# Altium schematic sheet lightSoakV1-InAmp-piggyback-sch.SchDoc
size A4; SheetNumber: 1; SheetTotal: 1
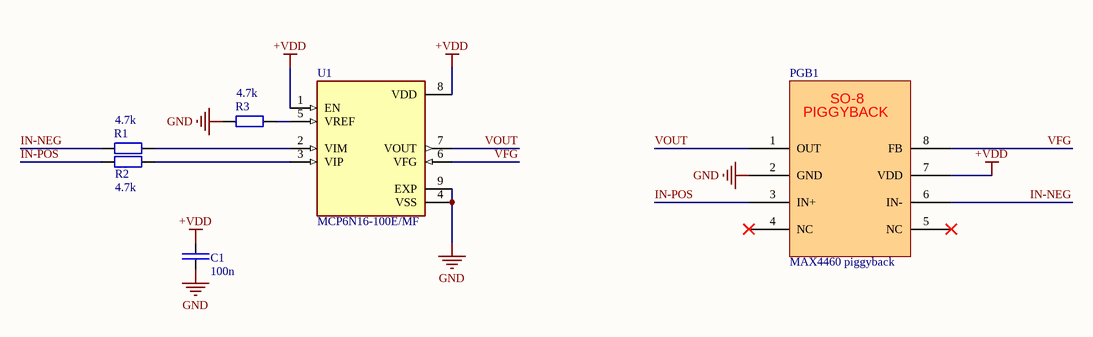
[diagram p0: lightSoakV1-InAmp-piggyback-sch.SchDoc]

## Parts
C1  value 100n  [FPR_0402_C_R0]  (hidden comment: PN_C_100n)
PGB1  MAX4460 piggyback  [SO-8 piggyback]
R1  value 4.7k  [FPR_0402_R_R0]  (hidden comment: PN_R_4k7)
R2  value 4.7k  [FPR_0402_R_R0]  (hidden comment: PN_R_4k7)
R3  value 4.7k  [FPR_0402_R_R0]  (hidden comment: PN_R_4k7)
U1  MCP6N16-100E/MF  [SON65P300X300X100-9N]

## Nets
+VDD: C1.2 PGB1.7(VDD) U1.1(EN) U1.8(VDD)
GND: C1.1 PGB1.2(GND) R3.2 U1.4(VSS) U1.9(EXP)
IN-NEG: PGB1.6(IN-) R1.2
IN-POS: PGB1.3(IN+) R2.2
VFG: PGB1.8(FB) U1.6(VFG)
VOUT: PGB1.1(OUT) U1.7(VOUT)
NetR1_1: R1.1 U1.2(VIM)
NetR2_1: R2.1 U1.3(VIP)
NetR3_1: R3.1 U1.5(VREF)

Not connected (* = marked no-connect by the designer): PGB1 4(NC)* 5(NC)*

## Notes on the sheet
- (in symbol MAX4460 piggyback) SO-8; PIGGYBACK

## Library data of the parts
C1 = C: Capacitor - generic SMD
R1-R3 = R: Resistor - generic SMD
U1 = MCP6N16-100E/MF: Instrumentation Amplifier 1 Circuit Rail-to-Rail 8-DFN-EP (3x3); MF: Microchip; MP: MCP6N16-100E/MF; Package: DFN-8 Microchip; Availability: In Stock; Price: None; Purchase-URL: https://pricing.snapeda.com/search/part/MCP6N16-100E/MF/?ref=eda; Check_prices: https://www.snapeda.com/parts/MCP6N16-100E/MF/Microchip/view-part/?ref=eda; SnapEDA_Link: https://www.snapeda.com/parts/MCP6N16-100E/MF/Microchip/view-part/?ref=snap; Value: *